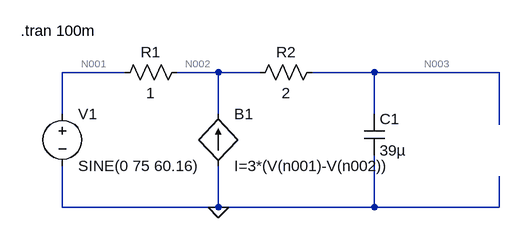
[diagram p0: schematic Q6 a1.asc]
Q6 a1.asc, the LTspice schematic file:
Version 4.1
SHEET 1 880 680
WIRE -16 80 -112 80
WIRE 128 80 64 80
WIRE 192 80 128 80
WIRE 368 80 272 80
WIRE 560 80 368 80
WIRE -112 144 -112 80
WIRE 128 144 128 80
WIRE 368 144 368 80
WIRE 560 160 560 80
WIRE -112 288 -112 224
WIRE 128 288 128 224
WIRE 128 288 -112 288
WIRE 368 288 368 208
WIRE 368 288 128 288
WIRE 560 288 560 240
WIRE 560 288 368 288
FLAG 128 288 0
SYMBOL voltage -112 128 R0
WINDOW 123 0 0 Left 0
WINDOW 39 0 0 Left 0
SYMATTR InstName V1
SYMATTR Value SINE(0 75 60.16)
SYMBOL res 80 64 R90
WINDOW 0 0 56 VBottom 2
WINDOW 3 32 56 VTop 2
SYMATTR InstName R1
SYMATTR Value 1
SYMBOL res 288 64 R90
WINDOW 0 0 56 VBottom 2
WINDOW 3 32 56 VTop 2
SYMATTR InstName R2
SYMATTR Value 2
SYMBOL cap 352 144 R0
SYMATTR InstName C1
SYMATTR Value 39µ
SYMBOL bi2 128 144 R0
SYMATTR InstName B1
SYMATTR Value I=3*(V(n001)-V(n002))
TEXT -176 16 Left 2 !.tran 100m

The netlist it stands for:
* Q6 a1.asc
V1 N001 0 SINE(0 75 60.16)
R1 N002 N001 1
R2 N003 N002 2
C1 N003 0 39µ
B1 0 N002 I=3*(V(n001)-V(n002))
.tran 100m
.backanno
.end

* Results of the author's LTspice run, read from the files saved beside the schematic
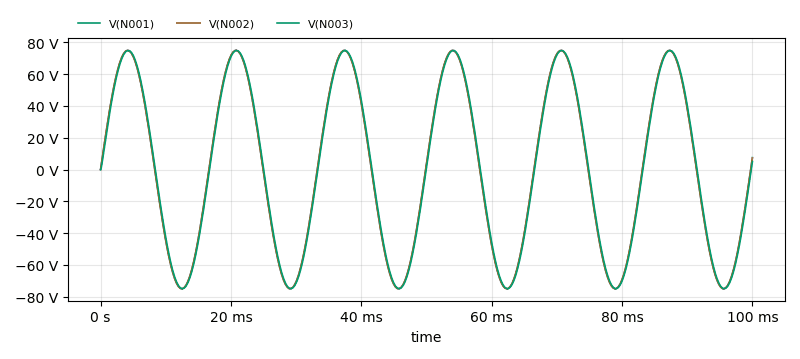
[diagram p1: Transient Analysis of Q6 a1.asc, plotted from the saved traces]
* Transient Analysis, 1 run:
*   V(N001): min -75 V, max 75 V, average 9.883 mV, rms 52.96 V, last 7.527 V
*   V(N002): min -74.99 V, max 74.99 V, average 9.391 mV, rms 52.96 V, last 7.251 V
*   V(N003): min -74.96 V, max 74.96 V, average 5.454 mV, rms 52.93 V, last 5.046 V